# Altium schematic sheet Sensors.SchDoc
size A3; SheetNumber: 11; SheetTotal: 11
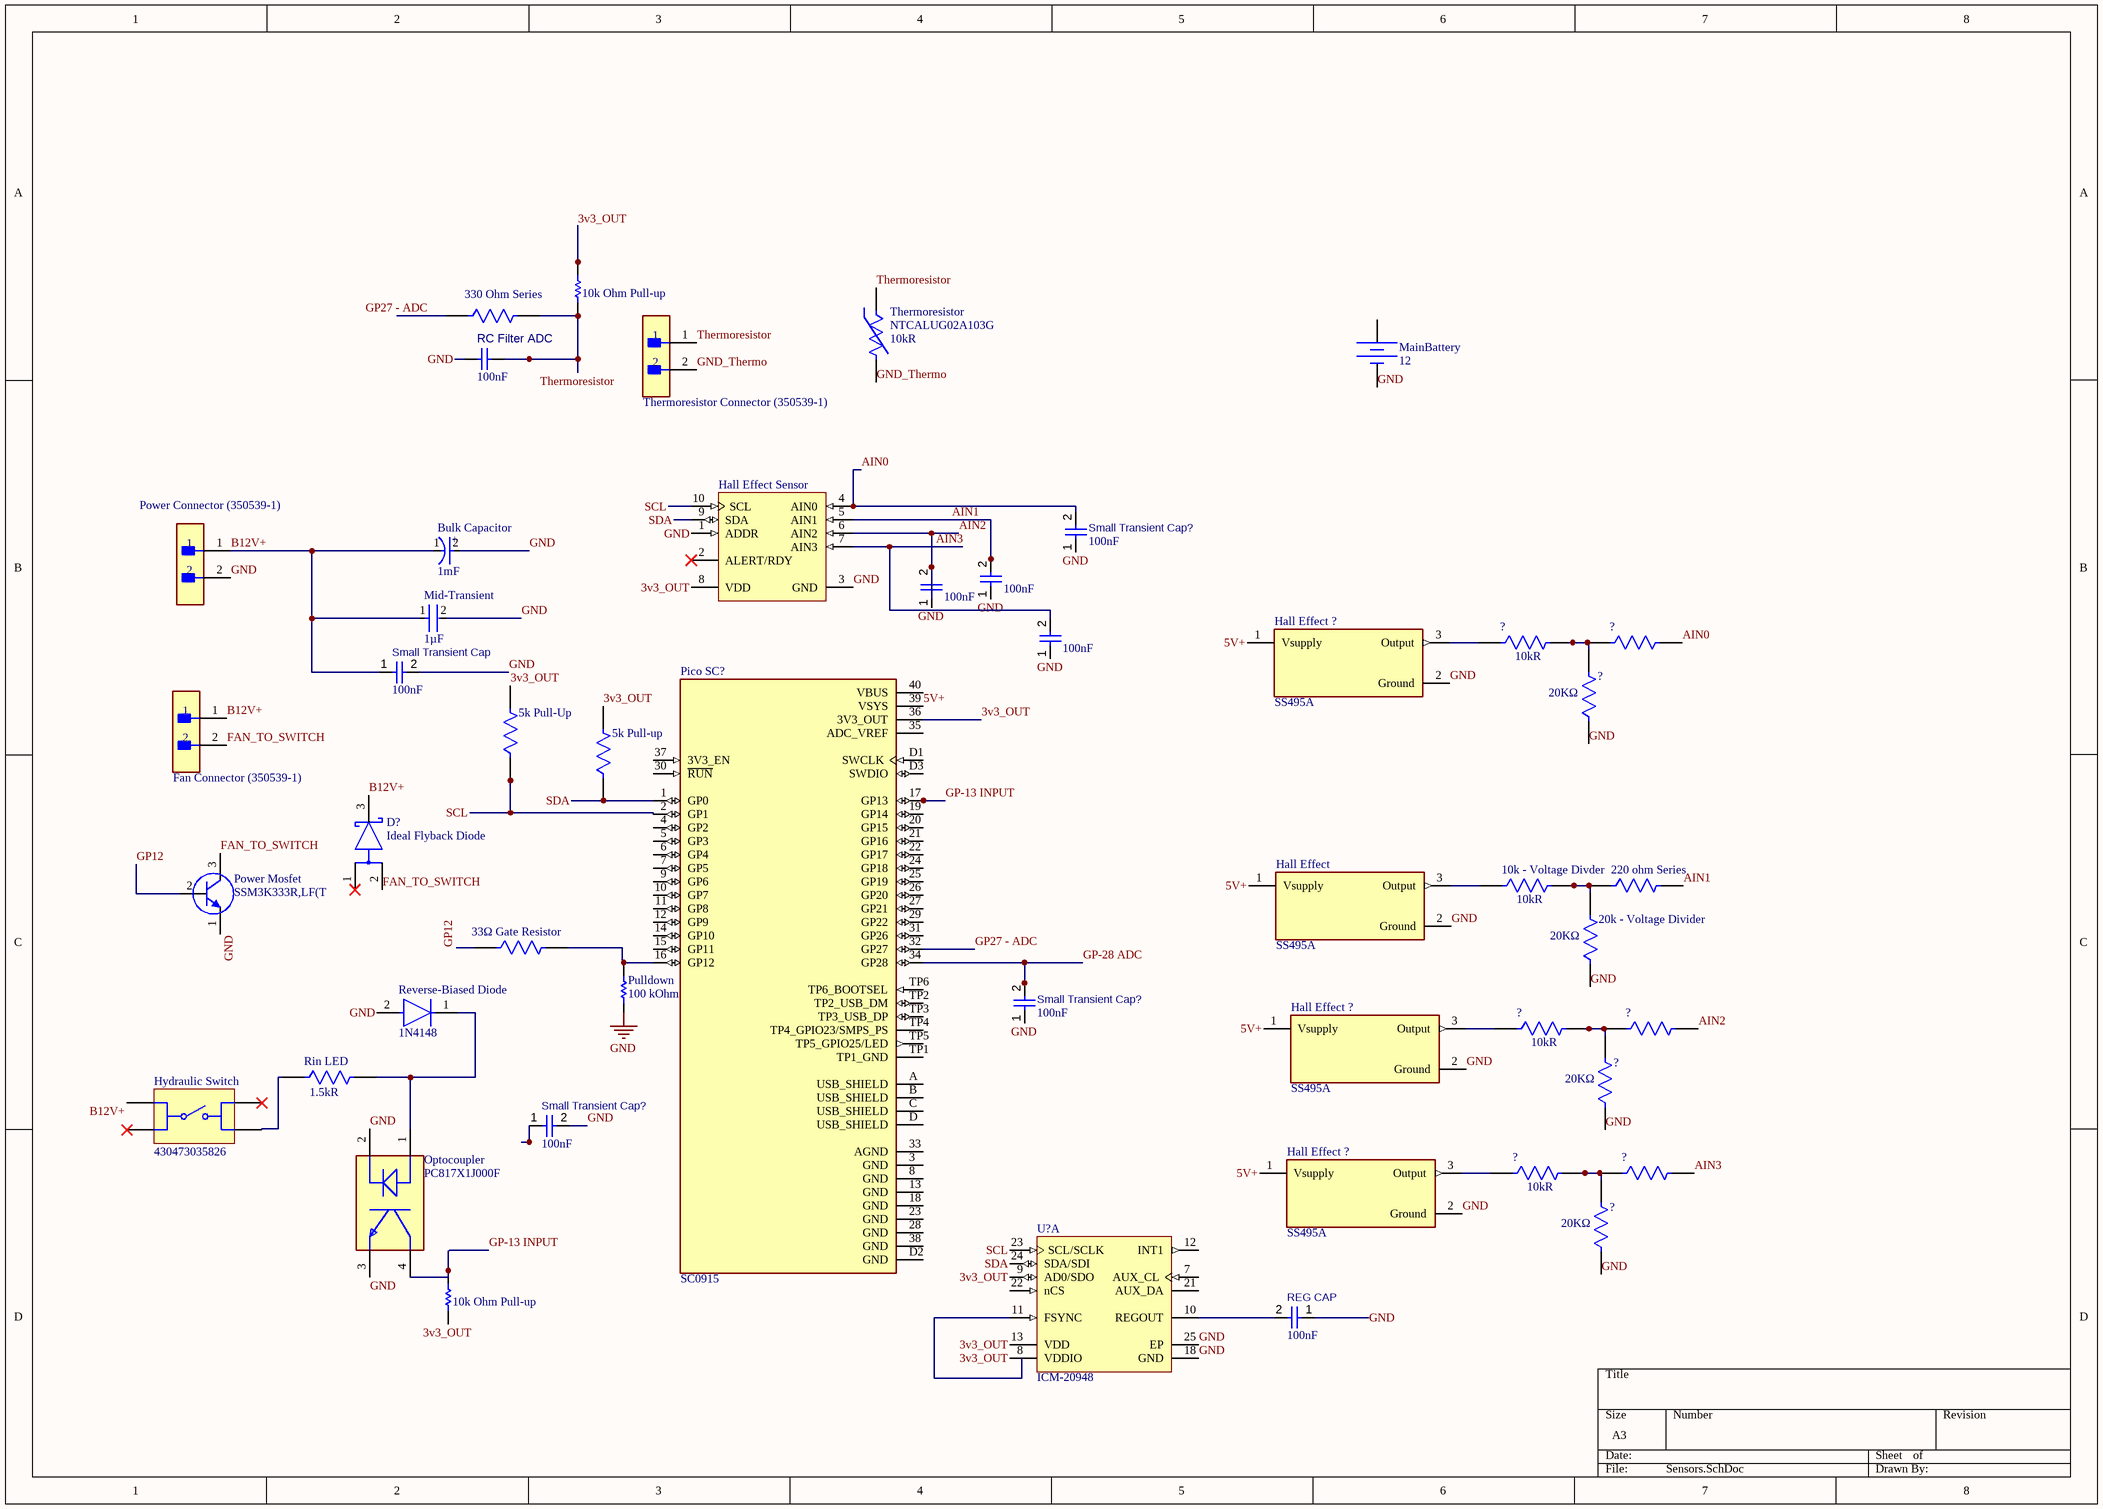
[diagram p0: Sensors.SchDoc]

## Parts
(Parts that share a designator on the sheet are numbered #1, #2 ... from top to bottom, then left to right.)
5k_Pull-Up#1  PLT0805Z5001AST5  [FP-PLT0805-MFG]  (value not drawn)
5k_Pull-up#2  PLT0805Z5001AST5  [FP-PLT0805-MFG]  (value not drawn)
10k_-_Voltage_Divder  Resistance: 10kR  [FP-CRCW1218-e3-IPC_B]  (hidden comment: CRCW121810K0FKEK)
10k_Ohm_Pull-up#1  CRCW121010K0JNEA  [RESC3225X60X45LL20T20]  (value not drawn)
10k_Ohm_Pull-up#2  CRCW121010K0JNEA  [RESC3225X60X45LL20T20]  (value not drawn)
20k_-_Voltage_Divider  value 20KΩ  [FP-RT0402-MFG]  (hidden comment: RT0402FRE0720KL)
220_ohm_Series  CRCW2512220RJNEG  [FP-CRCW2512-e3-IPC_A]  (value not drawn)
330_Ohm_Series  ERJH3GJ331V  [FP-ERJH3G-MFG]  (value not drawn)
?#1  Resistance: 10kR  [FP-CRCW1218-e3-IPC_B]  (hidden comment: CRCW121810K0FKEK)
?#2  CRCW2512220RJNEG  [FP-CRCW2512-e3-IPC_A]  (value not drawn)
?#3  value 20KΩ  [FP-RT0402-MFG]  (hidden comment: RT0402FRE0720KL)
?#4  Resistance: 10kR  [FP-CRCW1218-e3-IPC_B]  (hidden comment: CRCW121810K0FKEK)
?#5  CRCW2512220RJNEG  [FP-CRCW2512-e3-IPC_A]  (value not drawn)
?#6  value 20KΩ  [FP-RT0402-MFG]  (hidden comment: RT0402FRE0720KL)
?#7  Resistance: 10kR  [FP-CRCW1218-e3-IPC_B]  (hidden comment: CRCW121810K0FKEK)
?#8  CRCW2512220RJNEG  [FP-CRCW2512-e3-IPC_A]  (value not drawn)
?#9  value 20KΩ  [FP-RT0402-MFG]  (hidden comment: RT0402FRE0720KL)
Bulk_Capacitor  value 1mF  [FP-RAD-TH-D_10_0_5-L_30_2-MFG]  (hidden comment: Ideal Bulk Capacitor for High Current/Voltage (12V - 2.5A))
D?  Ideal Flyback Diode  [FP-340BQ-MFG]
Fan_Connector#1  Thermoresistor Connector (350539-1)  [FP-350539-1-MFG]
Fan_Connector#2  Fan Connector (350539-1)  [FP-350539-1-MFG]
Gate_Resistor  Resistance: 33Ω  [FP-RT1206-MFG]  (hidden comment: 33)
Hall_Effect  SS495A  [FP-SS495A-MFG]
Hall_Effect_?#1  SS495A  [FP-SS495A-MFG]
Hall_Effect_?#2  SS495A  [FP-SS495A-MFG]
Hall_Effect_?#3  SS495A  [FP-SS495A-MFG]
Hall_Effect_Sensor  ADS1115IDGST  [TI-DGS10_M]  (value not drawn)
Hydraulic_Switch  430473035826  [430473035826]
MainBattery  DC Magnitude: 12  (hidden comment: Constant Voltage Source)
Mid-Transient  value 1µF  [FP-GRM219-0_1-MFG]  (hidden comment: Mid-transient Capacitor - GRM219R7YA105KA12D)
Optocoupler  PC817X1J000F  [FP-PC817X1J000F-MFG]
Pico_SC?  SC0915  [MODULE_SC0915]
Power_Connector  Power Connector (350539-1)  [FP-350539-1-MFG]
Power_Mosfet  SSM3K333R,LF(T
Pulldown  100 kOhm  [RESC1609X55X30ML10T20]
RC_Filter_ADC  value 100nF  (hidden comment: Small-Transient Cap - GMK107B7104KAHT)
REG_CAP  value 100nF  (hidden comment: Small-Transient Cap - GMK107B7104KAHT)
Reverse-Biased_Diode  1N4148  [FP-017AG-MFG]
Rin_LED  Resistance: 1.5kR  [FP-CRCW0805-e3-MFG]  (hidden comment: CRCW08051K50JNEA)
Small_Transient_Cap  value 100nF  (hidden comment: Small-Transient Cap - GMK107B7104KAHT)
Small_Transient_Cap?#1  value 100nF  (hidden comment: Small-Transient Cap - GMK107B7104KAHT)
Small_Transient_Cap?#2  value 100nF  (hidden comment: Small-Transient Cap - GMK107B7104KAHT)
Small_Transient_Cap?#3  value 100nF  (hidden comment: Small-Transient Cap - GMK107B7104KAHT)
Small_Transient_Cap?#4  value 100nF  (hidden comment: Small-Transient Cap - GMK107B7104KAHT)
Small_Transient_Cap?#5  value 100nF  (hidden comment: Small-Transient Cap - GMK107B7104KAHT)
Small_Transient_Cap?#6  value 100nF  (hidden comment: Small-Transient Cap - GMK107B7104KAHT)
Thermoresistor  NTCALUG02A103G  Resistance: 10kR  [FP-NTCALUG02A103G-MFG]
U?  ICM-20948  [TDK-QFN-24_L]  (part A of 2)

## Nets
GND: 20k_-_Voltage_Divider.1 ?#3.1 ?#6.1 ?#9.1 Bulk_Capacitor.2(A) Hall_Effect.2(Ground) Hall_Effect_?#1.2(Ground) Hall_Effect_?#2.2(Ground) Hall_Effect_?#3.2(Ground) Hall_Effect_Sensor.1(ADDR) Hall_Effect_Sensor.3(GND) MainBattery.2 Mid-Transient.2 Optocoupler.2(C) Optocoupler.3(E) Power_Connector.2 Power_Mosfet.1(E) RC_Filter_ADC.1 REG_CAP.1 Reverse-Biased_Diode.2(A) Small_Transient_Cap.2 Small_Transient_Cap?#1.1 Small_Transient_Cap?#2.1 Small_Transient_Cap?#3.1 Small_Transient_Cap?#4.1 Small_Transient_Cap?#5.1 Small_Transient_Cap?#6.2 U?.18(GND) U?.25(EP)
3v3_OUT: 5k_Pull-Up#1.2 5k_Pull-up#2.2 10k_Ohm_Pull-up#1.2 10k_Ohm_Pull-up#2.1 Hall_Effect_Sensor.8(VDD) Pico_SC?.36(3V3_OUT) U?.8(VDDIO) U?.9(AD0/SDO) U?.13(VDD)
5V+: Hall_Effect.1(Vsupply) Hall_Effect_?#1.1(Vsupply) Hall_Effect_?#2.1(Vsupply) Hall_Effect_?#3.1(Vsupply) Pico_SC?.39(VSYS)
AIN0: ?#2.2 Hall_Effect_Sensor.4(AIN0) Small_Transient_Cap?#1.2
AIN1: 220_ohm_Series.2 Hall_Effect_Sensor.5(AIN1) Small_Transient_Cap?#2.2
AIN2: ?#5.2 Hall_Effect_Sensor.6(AIN2) Small_Transient_Cap?#3.2
AIN3: ?#8.2 Hall_Effect_Sensor.7(AIN3) Small_Transient_Cap?#4.2
B12V+: Bulk_Capacitor.1(C) D?.3(C) Fan_Connector#2.1 Hydraulic_Switch.A1 Mid-Transient.1 Power_Connector.1 Small_Transient_Cap.1
FAN_TO_SWITCH: D?.2(A) Fan_Connector#2.2 Power_Mosfet.3(C)
GND_Thermo: Fan_Connector#1.2 Thermoresistor.2
GP12: Gate_Resistor.1 Power_Mosfet.2(B)
GP27 - ADC: 330_Ohm_Series.1 Pico_SC?.32(GP27)
GP-13 INPUT: 10k_Ohm_Pull-up#2.2 Optocoupler.4(C) Pico_SC?.17(GP13)
GP-28 ADC: Pico_SC?.34(GP28) Small_Transient_Cap?#5.2
SCL: 5k_Pull-Up#1.1 Hall_Effect_Sensor.10(SCL) Pico_SC?.2(GP1) U?.23(SCL/SCLK)
SDA: 5k_Pull-up#2.1 Hall_Effect_Sensor.9(SDA) Pico_SC?.1(GP0) U?.24(SDA/SDI)
Thermoresistor: 10k_Ohm_Pull-up#1.1 330_Ohm_Series.2 Fan_Connector#1.1 RC_Filter_ADC.2 Thermoresistor.1
Net10k_-_Voltage_Divder_1: 10k_-_Voltage_Divder.1 Hall_Effect.3(Output)
Net10k_-_Voltage_Divder_2: 10k_-_Voltage_Divder.2 20k_-_Voltage_Divider.2 220_ohm_Series.1
Net?#1_1: ?#1.1 Hall_Effect_?#1.3(Output)
Net?#1_2: ?#1.2 ?#2.1 ?#3.2
Net?#4_1: ?#4.1 Hall_Effect_?#2.3(Output)
Net?#4_2: ?#4.2 ?#5.1 ?#6.2
Net?#7_1: ?#7.1 Hall_Effect_?#3.3(Output)
Net?#7_2: ?#7.2 ?#8.1 ?#9.2
NetGate_Resistor_2: Gate_Resistor.2 Pico_SC?.16(GP12) Pulldown.1
NetHydraulic_Switch_B2: Hydraulic_Switch.B2 Rin_LED.1
NetOptocoupler_1: Optocoupler.1(A) Reverse-Biased_Diode.1(C) Rin_LED.2
NetREG_CAP_2: REG_CAP.2 U?.10(REGOUT)

Not connected (* = marked no-connect by the designer): D? 1(A)*; Hall_Effect_Sensor 2(ALERT/RDY)*; Hydraulic_Switch A2* B1*; MainBattery 1; Pico_SC? 3(GND) 4(GP2) 5(GP3) 6(GP4) 7(GP5) 8(GND) 9(GP6) 10(GP7) 11(GP8) 12(GP9) 13(GND) 14(GP10) 15(GP11) 18(GND) 19(GP14) 20(GP15) 21(GP16) 22(GP17) 23(GND) 24(GP18) 25(GP19) 26(GP20) 27(GP21) 28(GND) 29(GP22) 30(~{RUN}) 31(GP26) 33(AGND) 35(ADC_VREF) 37(3V3_EN) 38(GND) 40(VBUS) A(USB_SHIELD) B(USB_SHIELD) C(USB_SHIELD) D(USB_SHIELD) D1(SWCLK) D2(GND) D3(SWDIO) TP1(TP1_GND) TP2(TP2_USB_DM) TP3(TP3_USB_DP) TP4(TP4_GPIO23/SMPS_PS) TP5(TP5_GPIO25/LED) TP6(TP6_BOOTSEL); Pulldown 2; Small_Transient_Cap?#6 1; U? 7(AUX_CL) 11(FSYNC) 12(INT1) 21(AUX_DA) 22(nCS)

## Notes on the sheet
- Labels drawn without touching a wire or pin: GND
- (in symbol CMP-001-00084-1) +

## Library data of the parts
5k_Pull-Up#1 5k_Pull-up#2 = CMP-00030-44317389-1: PLT0805Z5001AST5 SMD Chip Resistor, 5 kOhm, ± 0.05%, 250 mW, 0805 [2012 Metric], Thin Film, Precision; Temperature Coefficient: 5ppm/°C; Resistance: 5kΩ; Voltage Rating: 100V; Power Rating: 250mW; Depth: 1.27mm; Length: 2.032mm; Case Code (Imperial): 0805; RoHS: Compliant; Case Code (Metric): 2012; Features: Moisture Resistant; Max Operating Temperature: 125°C; Min Operating Temperature: -55°C; Tolerance: 0.05%; NexarPartId: 44317389; Width: 1.27mm; Voltage Rating (DC): 100V; Max Power Dissipation: 250mW; Case/Package: 0805; Number of Terminations: 2; Composition: Thin Film; Schedule B: 8533210045; Military Standard: Not; Height: 838.2µm
10k_-_Voltage_Divder ?#1 ?#4 ?#7 = CMP-02407-008404-1: RES Thick Film, 10kΩ, 1%, 1W, 100ppm/°C, 1218; Voltage Rating: 200V; Tolerance: 5%; Temperature Coefficient: 100ppm/°C; Min Operating Temperature: -55°C; Case/Package: 1218; Length: 3.2mm; Contact Plating: Tin; Package Quantity: 4000; Case Code (Imperial): 1218; Case Code (Metric): 3246; Lead Free: Lead Free; Width: 4.6mm; Radiation Hardening: No; Weight: 0.001041oz; Composition: Thick Film; Packaging: Tape and Reel; Height: 0.55mm; Max Operating Temperature: 155°C; Power Rating: 1W
10k_Ohm_Pull-up#1 10k_Ohm_Pull-up#2 = CMP-2005-01994-1: Manufacturer: Vishay Dale; Part Number: CRCW121010K0JNEA
20k_-_Voltage_Divider ?#3 ?#6 ?#9 = CMP-2002-02549-2: RES SMD 20K OHM 1% 1/16W 0402; Manufacturer: Yageo; Voltage Rating: 50V; Temperature Coefficient: 50 ppm/°C; Tolerance: 0.01; Power Rating: 0.063W; Height: 0.35mm; Package: RT0402; Device Class L3: Chip SMD Resistors; Resistance: 20KΩ; Temperature: -55°C to +155°C; Device Class L1: Passive Components; Category: Res; Series: RT; Composition: Thin Film; RoHS: TRUE; Device Class L2: Resistors; Digikey Description: RES SMD 20K OHM 1% 1/16W 0402; Mouser Description: Res Thin Film 0402 20K Ohm 1% 1/16W ±50ppm/°C Molded SMD SMD Paper T/R; ComponentLink2URL: http://www.yageo.com/documents/recent/PYu-RT_1-to-0.01_RoHS_L_9.pdf; Manufacturer Part Number: RT0402FRE0720KL; Automotive: No; Temperature Range Low: -55°C; Footprint Url: http://www.yageo.com/exep/pages/download/literatures/PYu-R_Mount_10.pdf; Temperature Range High: +155°C; Octopart: https://octopart.com/rt0402fre0720kl-yageo-1412788; ComponentLink2Description: Datasheet; Ipc Land Pattern Name: RESC10050X30; Lead Free: Yes
220_ohm_Series ?#2 ?#5 ?#8 = CMP-02407-001846-1: RES Thick Film, 220Ω, 5%, 1W, 200ppm/°C, 2512; Resistance: 220R; Voltage Rating: 500V; Tolerance: 5%; Height: 0.6mm; Mount: Surface Mount; Max Operating Temperature: 155°C; Max Power Dissipation: 1W; Contact Plating: Tin; Packaging: Tape and Reel; Width: 0.124inch; Termination: SMD/SMT; Depth: 3.15mm; Case Code (Imperial): 2512; Package Quantity: 1; Lead Free: Lead Free; Temperature Coefficient: 200ppm/°C; Weight: 0.001429oz; Radiation Hardening: No; Case Code (Metric): 6432; Power Rating: 1W; Features: Automotive AEC-Q200; Number of Terminations: 2; Min Operating Temperature: -55°C; Voltage Rating (DC): 500V; Military Standard: Not; Number of Pins: 2; Composition: Thick Film; Case/Package: 2512; Length: 6.3mm
330_Ohm_Series = CMP-00287-116338145-1: ERJH3GJ331V Res 330 Ohm 5% 1/8W 0603; NexarPartId: 116338145
Bulk_Capacitor = CMP-001-00084-1: Cap Aluminum Lytic 1000uF 35V 20%( 10 X 30mm) Radial 5mm 2140mA 4000h 105C Automotive Bulk; Part Series: FK-A; Manufacturer Lifecycle Status: ACTIVE; Ripple Current: 2.14A; Dissipation Factor: 12%; Leakage Current: 350µA; Life (Hours): 4000hours; Dielectric Material: Aluminium; Lead/Base Style: Straight; Lead Diameter: 600µm; REACH SVHC: Yes; Number of Terminals: 2; Mounting Technology: Through Hole; Packaging: Bulk; Tolerance: 20%; Termination: Radial; Terminal Pitch: 5mm; Export Control Classification Number (ECCN) Code: EAR99; Radiation Hardening: No; Voltage Rating: 35V; Introduction Date: 2002-03-01; RoHS: Compliant; Lead Pitch: 5mm; Diameter: 10mm; Lifecycle Status: Production; Height: 32mm; Contact Plating: Tin; Harmonized Tariff Schedule (HTS) Code: 8532.22.00.20; Country of Origin: Malaysia; Voltage Rating (DC): 35V; Pins: 2; Voltage: 35V; Schedule B: 8532220020, 8532220020; Min Operating Temperature: -55°C; Length: 30mm; Case/Package: Radial; Max Operating Temperature: 105°C
D? = CMP-004-00031-1: Rectifier Diode, Schottky, 1 Phase, 1 Element, 5A, 40V V(RRM), Silicon, TO-277; Manufacturer Lifecycle Status: ACTIVE; Max Forward Surge Current (Ifsm): 150A; Peak Reverse Current: 250µA; Element Configuration: Single; Max Junction Temperature (Tj): 150°C; Number of Elements: 1; Forward Voltage: 520mV; Value: 730pF; Forward Current: 5A; Country of Origin: Mainland China; Export Control Classification Number (ECCN) Code: EAR99; Schedule B: 8541100080, 8541100080; Height: 1.2mm; Max Reverse Voltage (DC): 40V; Max Repetitive Reverse Voltage (Vrrm): 40V; Average Rectified Current: 5A; Harmonized Tariff Schedule (HTS) Code: 8541.10.00.80; Packaging: Cut Tape; Mounting Technology: Surface Mount; Min Operating Temperature: -55°C; Max Output current: 5A; Number of Terminals: 3; Weight: 113.6mg; Max Operating Temperature: 150°C; Introduction Date: 2015-10-16; China RoHS: Non-Compliant; Lifecycle Status: Production; Reverse Standoff Voltage: 40V; REACH SVHC: No; Reverse Voltage: 40V; RoHS: Compliant; Case/Package: TO-277-3
Fan_Connector#1 Fan_Connector#2 Power_Connector = CMP-03369-000078-1: CONN HEADER VERT 2POS 5.08MM; Manufacturer: TE Connectivity; Current Rating: 12A; Conn Orientation: Vertical; Number Of Contacts: 2; Conn Gender: Male; Standoff Height: 0.025inch; Voltage Rating: 250V; Category: Conn; Height: 0.41inch; Device Class L3: unset; Number Of Rows: 1; Temperature: -55°C to +105°C; ComponentLink2URL: https://www.te.com/usa-en/product-350539-1.html?te_bu=Cor&te_type=other&te_campaign=oct_glo_cor-oct-global-oth-prtnr-fy19-oct-octo-buy-bom_sma-298_2&elqCampaignId=35216; Manufacturer Part Number: 350539-1; Automotive: No; Mouser Description: Pin & Socket Connectors CONN PCM 2 POS TIN; ComponentLink2Description: Datasheet; Lead Free: Yes; Device Class L1: Connectors; Device Class L2: Headers and Wire Housings; Octopart: https://octopart.com/350539-1-te+connectivity-46510628; Digikey Description: CONN HEADER VERT 2POS 5.08MM; RoHS: TRUE; Temperature Range Low: -55°C; Package: 350539-1; Temperature Range High: +105°C; Contact Material: Gold,Nickel; Pitch: 5.08mm
Gate_Resistor = CMP-2003-04210-2: RES SMD 33 OHM 0.1% 1/4W 1206; Manufacturer Part Number: RT1206BRD0733RL; Manufacturer: Yageo; Power Rating: 0.25W; Voltage Rating: 200V; Temperature Coefficient: 25 ppm/°C; Value: 33Ω; Tolerance: 0.005; Footprint Url: http://www.yageo.com/exep/pages/download/literatures/PYu-R_Mount_10.pdf; Digikey Description: RES SMD 33 OHM 0.1% 1/4W 1206; Device Class L3: Chip SMD Resistors; Device Class L1: Passive Components; Temperature Range Low: -55°C; Series: RT; Composition: Thin Film; Ipc Land Pattern Name: RESC310160X55; Octopart: https://octopart.com/rt1206brd0733rl-yageo-1483167; Device Class L2: Resistors; Automotive: No; Mouser Description: Res Thin Film 1206 33 Ohm 0.1% 1/4W ±25ppm/°C Molded SMD SMD Paper T/R; Temperature Range High: +155°C; RoHS: TRUE; Height: 0.65mm; Package: RT1206; ComponentLink2Description: Datasheet; Lead Free: Yes; Temperature: -55°C to +155°C; ComponentLink2URL: http://www.yageo.com/documents/recent/PYu-RT_1-to-0.01_RoHS_L_9.pdf; Category: Res
Hall_Effect Hall_Effect_?#1-Hall_Effect_?#3 = CMP-11168-000007-1: SENSOR HALL ANALOG RADIAL LEAD; Operating Supply Voltage: 9V; Sensing Method: Hall Effect; Max Voltage Rating (DC): 10.5V; Max Output Current: 10mA; Min Supply Voltage: 4.5V; Min Output Voltage: 200mV; Leakage Current: 10uA; Number of Contacts: 3; Linearity: -1%; Nominal Supply Current: 8.7mA; Switching Current: 1.5mA; Connector Type: Soldering; Input Current: 7mA; Sensitivity: 0.125mV/g; Response Time: 3us; Max Operating Temperature: 150°C; Mount: Through Hole; Type: Integrated Circuit (IC); Width: 0.118inch; Output Type: Analog; Package Quantity: 1000; Max Supply Voltage (DC): 10.5V; Height: 0.063inch; Depth: 1.6mm; REACH SVHC: No SVHC; Case/Package: TO-92; Output Voltage: 200mV; Packaging: Bulk; Termination: SMD/SMT; Lead Free: Lead Free; Length: 0.159inch; Radiation Hardening: No; Output Current: 10mA; Min Supply Voltage (DC): 4.5V; Min Operating Temperature: -40°C; Max Supply Voltage: 10.5V; Number of Pins: 3; Operating Supply Current: 7mA
Hall_Effect_Sensor = CMP-0003-00378-2: 16-Bit ADC with Integrated Multiplexer, PGA, Comparator, Oscillator, and Reference, -40 to 125 degC, 10-pin SOP (DGS10), Green (RoHS & no Sb/Br); Manufacturer: Texas Instruments; Sample Rate (max)(SPS): 860; SubFamily: Precision ADC (<=10MSPS); Architecture: Delta-Sigma; Digital Supply(Min)(V): 2; Resolution(Bits): 16; Digital Supply(Max)(V): 5.5; INL(Max)(+/-LSB): 1; Interface: Serial I2C; # Input Channels: 4; Eco-Plan: Green (RoHS & no Sb/Br); PackageDescription: 10-Pin Plastic Small Outline, Body 3 x 3 mm, Pitch 0.5 mm; Mounting Technology: Surface Mount; PackageReference: DGS10; DatasheetVersion: SBAS444B; ComponentLink3Description: Package Specification; ComponentLink1Description: Manufacturer URL; PartNumber: ADS1115IDGST; ComponentLink3URL: http://www.ti.com/lit/ml/mpds035b/mpds035b.pdf; ComponentLink2URL: http://www.ti.com/general/docs/lit/getliterature.tsp?genericPartNumber=ADS1115&fileType=pdf; Analog Voltage AV/DD(Min)(V): 2; ComponentLink2Description: Datasheet; PackageVersion: 4073272/C, 02/2004; Analog Voltage AV/DD(Max)(V): 5.5; Code_JEDEC: MO-153; ComponentLink1URL: http://www.ti.com/
Hydraulic_Switch = CMP-1455-00006-5: Switch Tactile Spst-no 0.05A 12V; Actuator Material: Liquid Crystal Polymer, Polymer; Switch Travel: 250µm; Throw Configuration: SPST; Illumination Type: Non-Illuminated; Insulation Resistance: 100MΩ; Current Rating: 50mA; Switch Function: Off-Mom; Mechanical Life: 500kcycles; Min Operating Temperature: -40°C; Packaging: Tape and Reel; Max Operating Temperature: 85°C; Mount: Surface Mount; Contact Plating: Silver; RoHS: Compliant; Voltage Rating: 12V; Height: 3.5mm
MainBattery = Battery: SimulationGenericComponent: True
Mid-Transient = CMP-001-00085-1: 35V 1uF X7R ±10% 0805 Multilayer Ceramic Capacitors MLCC - SMD/SMT ROHS; Manufacturer Lifecycle Status: IN PRODUCTION; Dielectric: X7R; Min Operating Temperature: -55°C; Dielectric Material: Ceramic; Termination: SMD/SMT; Material: Ceramic; Max Operating Temperature: 125°C; Export Control Classification Number (ECCN) Code: EAR99; Voltage Rating: 35V; Width: 1.25mm; Mounting Technology: Surface Mount; Case/Package: 0805; Schedule B: 8532240020, 8532240020; Country of Origin: Philippines; Length: 2mm; REACH SVHC: Yes; Tolerance: 10%; Packaging: Cut Tape (CT); Case Code (Imperial): 0805; Introduction Date: 2013-11-20; Case Code (Metric): 2012; RoHS: Compliant; Number of Terminals: 2; Weight: 9.49709mg; Lifecycle Status: Production; Harmonized Tariff Schedule (HTS) Code: 8532.24.00.20; Height: 850µm; Voltage Rating (DC): 35V; Thickness: 850µm
Optocoupler = CMP-65434-000003-1: OPTOISOLATOR 5KV TRANS 4DIP; Collector Emitter Saturation Voltage: 200mV; Forward Voltage: 1.4V; Power Dissipation: 200mW; Input Current: 20mA; Max Collector Current: 50mA; Collector Emitter Breakdown Voltage: 80V; Rise Time: 18000ns; Number of Elements: 1; Reverse Breakdown Voltage: 6V; Current Transfer Ratio: 600%; Min Operating Temperature: -30°C; Number of Pins: 4; Radiation Hardening: No; Output Current per Channel: 50mA; Case/Package: DIP; Fall Time: 18000ns; Forward Current: 50mA; Isolation Voltage: 5kV; Package Quantity: 2000; Max Operating Temperature: 100°C; Packaging: Sleeve; Max Input Current: 50mA; Output Voltage: 80V; Max Power Dissipation: 200mW; Mount: Through Hole; Number of Channels: 1; Collector Emitter Voltage (VCEO): 80V
Pico_SC? = SC0915: RP2040 Raspberry Pi Pico series ARMÂ® CortexÂ®-M0+ MCU 32-Bit Embedded Evaluation Board; SnapEDA_Link: https://www.snapeda.com/parts/SC0915/Raspberry+Pi/view-part/?ref=snap; Availability: In Stock; Package: None; Price: None; MP: SC0915; Check_prices: https://www.snapeda.com/parts/SC0915/Raspberry+Pi/view-part/?ref=eda; MF: Raspberry Pi; Value: *; Purchase-URL: https://pricing.snapeda.com/search/part/SC0915/?ref=eda
Power_Mosfet = CMP-013-00035-1: N-Channel 30V 6A 2.5V @ 100uA 28mΩ @ 5A, 10V 1W SOT-23F MOSFET RoHS; Number of Elements: 1; Input Capacitance: 436pF; Min Breakdown Voltage: 30V; Max Power Dissipation: 1W; Lifecycle Status: Production; Export Control Classification Number (ECCN) Code: EAR99; Drain to Source Resistance: 28mΩ; RoHS: Compliant; Mounting Technology: Surface Mount; Drain to Source Voltage (Vdss): 30V; Continuous Drain Current (ID): 6A; Case/Package: SOT-23-3; Number of Terminals: 3; Introduction Date: 2014-03-19
Pulldown = CMP-2000-03685-1: Manufacturer: Vishay Dale; Part Number: TNPW0603100KBEEA
RC_Filter_ADC REG_CAP Small_Transient_Cap Small_Transient_Cap?#1-Small_Transient_Cap?#6 = CMP-001-00086-1: Multilayer Ceramic Capacitors MLCC - SMD/SMT .1uF 35Volts X7R +/-10% 0603 STD; Tolerance: 10%; Voltage Rating (DC): 35V; Case Code (Metric): 1608; Ratings: AEC-Q200; Width: 800µm; Length: 1.6mm; Case Code (Imperial): 0603; Max Width: 900µm; Min Width: 700µm; Min Operating Temperature: -55°C; Lifecycle Status: Production; Thickness: 889µm; Case/Package: 0603; Lead Free: Lead Free; Min Thickness: 700µm; Number of Terminals: 2; Material: Ceramic; Halogen Free: Halogen Free; Termination: SMD/SMT; Max Length: 1.7mm; Max Thickness: 900µm; Packaging: Cut Tape (CT); Max Operating Temperature: 125°C; Voltage Rating: 35V; Dielectric: X7R; RoHS: Compliant; Mounting Technology: Surface Mount; REACH SVHC: Yes; Min Length: 1.5mm; Height: 800µm; Dielectric Material: Ceramic
Reverse-Biased_Diode = CMP-07163-000046-1: DIODE GEN PURP 100V 200MA DO35; Forward Voltage: 1V; Max Power Dissipation: 500mW; Max Reverse Current: 5uA; Forward Current: 300mA; Current: 4A; Reverse Recovery Time: 4ns; Element Configuration: Single; Outside Diameter: 1.85mm; Capacitance: 4pF; Polarity: Standard; Max Forward Surge Current (Ifsm): 1A; Reverse Voltage: 100V; Output Current: 200mA; Average Rectified Current: 200mA; Diameter: 1.91mm; Max Repetitive Reverse Voltage (Vrrm): 100V; Current Rating: 200mA; Case/Package: DO-35; Lead Free: Lead Free; Number of Pins: 2; Recovery Time: 4ns; Packaging: Bulk; Contact Plating: Tin; Voltage: 100V; Mount: Through Hole; Max Surge Current: 4A; Package Quantity: 2000; Width: 1.91mm; Max Reverse Voltage (DC): 100V; Length: 4.56mm; Radiation Hardening: No; Power Dissipation: 500mW; Voltage Rating (DC): 100V; Peak Non-Repetitive Surge Current: 4A; REACH SVHC: No SVHC; Height: 4.56mm; Max Operating Temperature: 175°C; Series: -; Weight: 0.01lb; Min Operating Temperature: -65°C
Rin_LED = CMP-2001-04316-2: RES Thick Film, 1.5kΩ, 5%, 0.125W, 200ppm/°C, 0805; Voltage Rating: 150V; Power Rating: 125mW; Tolerance: 5%; Packaging: Tape and Reel; Weight: 0.000194oz; Case Code (Metric): 2012; Composition: Thick Film; Military Standard: Not; Voltage Rating (DC): 150V; Contact Plating: Tin; Temperature Coefficient: 200ppm/°C; Length: 2mm; Width: 1.25mm; Depth: 1.25mm; Lead Free: Lead Free; Min Operating Temperature: -55°C; Package Quantity: 5000; Case/Package: 0805; Height: 0.45mm; Termination: SMD/SMT; Max Operating Temperature: 155°C; Case Code (Imperial): 0805; Radiation Hardening: No
Thermoresistor = CMP-02404-000019-1: THERM NTC 10KOHM 3984K RING LUG; Max Power Dissipation: 100mW; Accuracy: 0.5%; Tolerance: 2%; Radiation Hardening: No; Depth: 4.1mm; Contact Plating: Tin; Length: 8.5mm; RoHS Compliant: Yes; Resistance Tolerance: 2%; Packaging: Bulk; Mount: Free Hanging; Termination: Wire; Package Quantity: 500; Max Operating Temperature: 125°C; Series: Automotive, AEC-Q200, NTCA; Number of Pins: 2; Min Operating Temperature: -55°C
U? = CMP-2000-07532-1: World’s Lowest Power 9-Axis MEMS MotionTracking(TM) Device, 1.71 to 3.6 V, -40 to 85 degC, 24-Pin QFN, RoHS, Tape and Reel; Manufacturer: TDK; Package Description: 24-Pin Quad Flat No-lead Package, Body 3 x 3 mm, Pitch 0.4 mm; Datasheet Version: Rev. 1.3, 06/2017; Package Reference: QFN-24; Mounting Technology: SurfaceMount; Datasheet URL: https://www.invensense.com/wp-content/uploads/2016/06/DS-000189-ICM-20948-v1.3.pdf; Manufacturer URL: http://www.tdk.com/